# Altium schematic sheet power.SchDoc
size A3
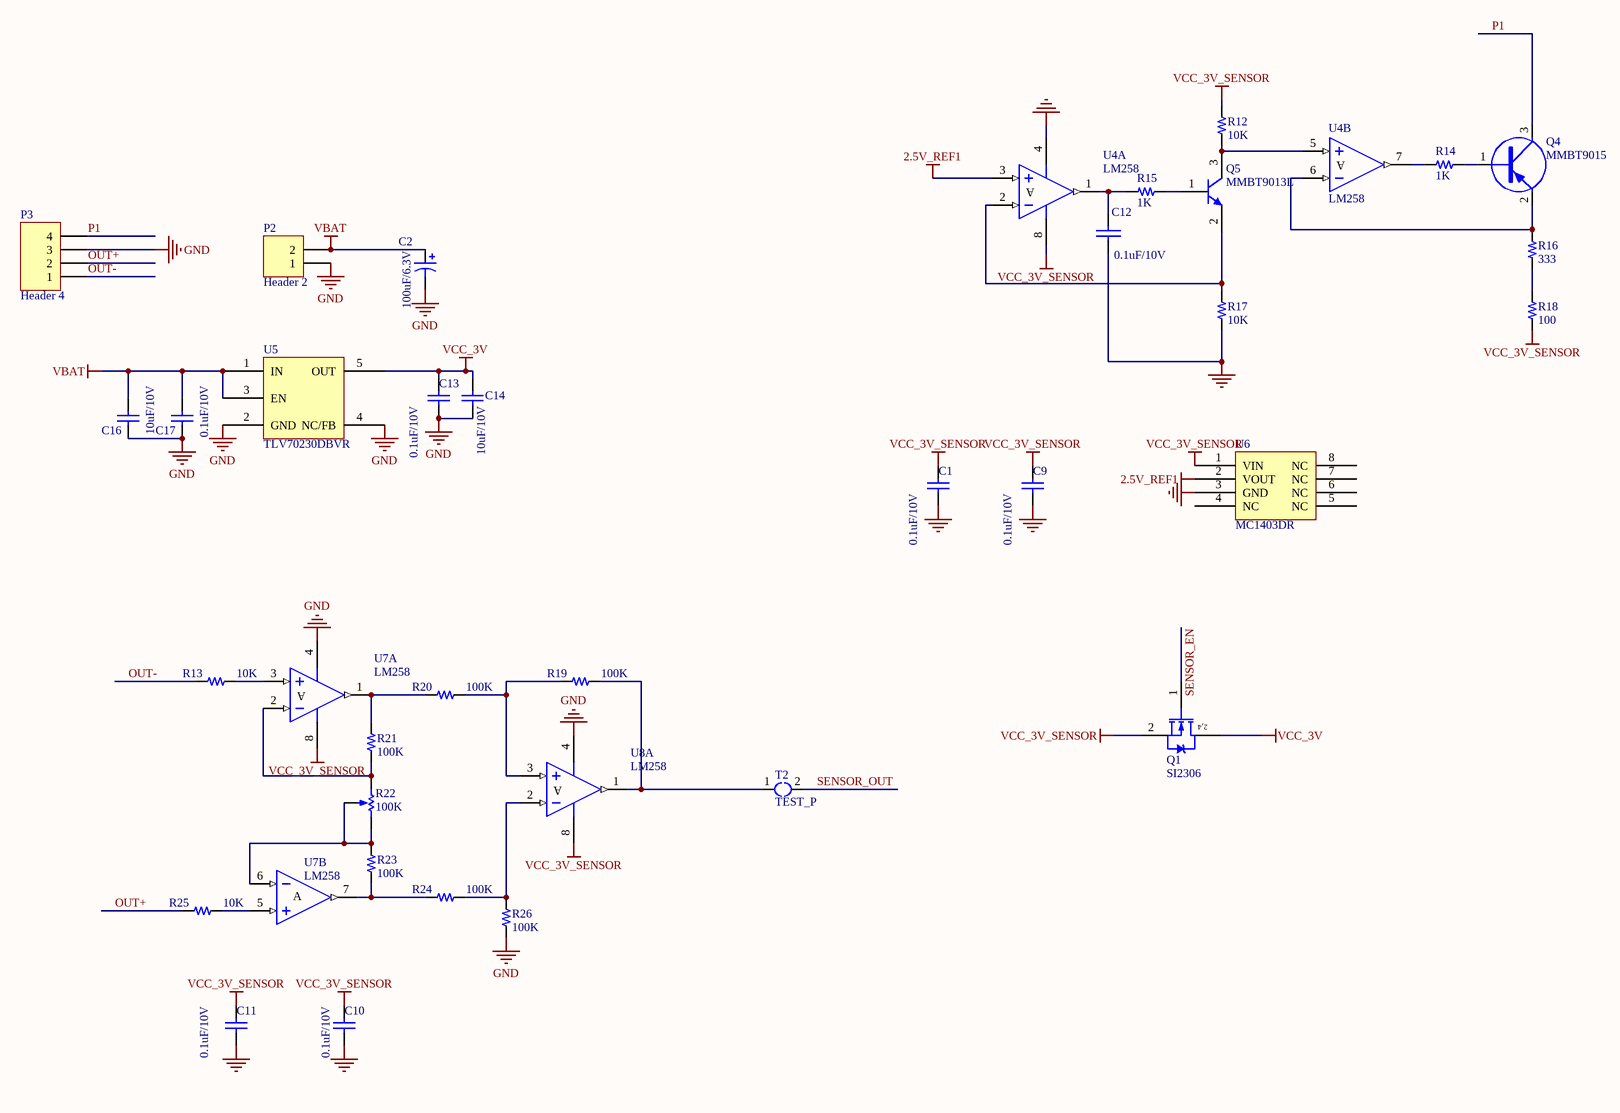
[diagram p0: power.SchDoc]

## Parts
C1  0.1uF/10V  [0603C]
C2  100uF/6.3V  [7343]
C9  0.1uF/10V  [0603C]
C10  0.1uF/10V  [0603C]
C11  0.1uF/10V  [0603C]
C12  0.1uF/10V  [0603C]
C13  0.1uF/10V  [0603C]
C14  10uF/10V  [0603C]
C16  10uF/10V  [0603C]
C17  0.1uF/10V  [0603C]
P2  Header 2  [2X2.54MM]
P3  Header 4  [HDR1X4]
Q1  SI2306  [SOT23-3]
Q4  MMBT9015  [SOT23-3]
Q5  MMBT9013L  [SOT23-3]
R12  10K  [0603R]
R13  10K  [0603R]
R14  1K  [0603R]
R15  1K  [0603R]
R16  333  [0603R]
R17  10K  [0603R]
R18  100  [0603R]
R19  100K  [0603R]
R20  100K  [0603R]
R21  100K  [0603R]
R22  100K  [HDR1X3]
R23  100K  [0603R]
R24  100K  [0603R]
R25  10K  [0603R]
R26  100K  [0603R]
T2  TEST_P  [TEST_P]
U4  LM258  [so-8]  (parts A,B of 2)
U5  TLV70230DBVR  [SOT23-5(DBV)]
U6  MC1403DR  [SO-8]
U7  LM258  [so-8]  (parts A,B of 2)
U8  LM258  [so-8]  (part A of 2)

## Nets
2.5V_REF1: U4.3(IN+) U6.2(VOUT)
GND: C1.2 C2.2 C9.2 C10.2 C11.2 C12.2 C13.2 C14.1 C16.1 C17.2 P2.1 P3.3 R17.1 R26.1 U4.4(V-) U5.2(GND) U5.4(NC/FB) U6.3(GND) U7.4(V-) U8.4(V-)
VBAT: C2.1 C16.2 C17.1 P2.2 U5.1(IN) U5.3(EN)
VCC_3V: C13.1 C14.2 Q1.3(D) U5.5(OUT)
VCC_3V_SENSOR: C1.1 C9.1 C10.1 C11.1 Q1.2(S) R12.2 R18.1 U4.8(V+) U6.1(VIN) U7.8(V+) U8.8(V+)
OUT+: P3.2 R25.1
OUT-: P3.1 R13.1
P1: P3.4 Q4.3(C)
SENSOR_EN: Q1.1(G)
SENSOR_OUT: T2.2
NetC12_1: C12.1 R15.1 U4.1(OUT)
NetQ4_1: Q4.1(B) R14.2
NetQ4_2: Q4.2(E) R16.2 U4.6(IN-)
NetQ5_1: Q5.1(B) R15.2
NetQ5_2: Q5.2(E) R17.2 U4.2(IN-)
NetQ5_3: Q5.3(C) R12.1 U4.5(IN+)
NetR13_2: R13.2 U7.3(IN+)
NetR14_1: R14.1 U4.7(OUT)
NetR16_1: R16.1 R18.2
NetR19_1: R19.1 R20.2 U8.3(IN+)
NetR19_2: R19.2 T2.1 U8.1(OUT)
NetR20_1: R20.1 R21.2 U7.1(OUT)
NetR21_1: R21.1 R22.1(TOP) U7.2(IN-)
NetR22_2: R22.2(BOT) R22.3(TAP) R23.2 U7.6(IN-)
NetR23_1: R23.1 R24.1 U7.7(OUT)
NetR24_2: R24.2 R26.2 U8.2(IN-)
NetR25_2: R25.2 U7.5(IN+)

Not connected (* = marked no-connect by the designer): U6 4(NC) 5(NC) 6(NC) 7(NC) 8(NC)

## Notes on the sheet
- (in symbol BUK92150-55A) 2,4
- (in symbol LM258, part A) A
- (in symbol LM258, part B) A

## Library data of the parts
C1 C9-C11 C13 C17 = Cap: Capacitor; Value: 104; Published: 8-Jun-2000; LatestRevisionDate: 17-Jul-2002; LatestRevisionNote: Re-released for DXP Platform.; PackageReference: RAD-0.3; Publisher: Altium Limited
C2 = Cap Pol1: Polarized Capacitor (Radial); Published: 8-Jun-2000; LatestRevisionDate: 17-Jul-2002; LatestRevisionNote: Re-released for DXP Platform.; PackageReference: RB7.6-15; Publisher: Altium Limited
C12 = CAP: Capacitor
C14 = Cap: Capacitor; Published: 8-Jun-2000; LatestRevisionDate: 17-Jul-2002; LatestRevisionNote: Re-released for DXP Platform.; PackageReference: RAD-0.3; Publisher: Altium Limited; Value: 10uF/10V
C16 = Cap: Capacitor; Value: 106/50V; Published: 8-Jun-2000; LatestRevisionDate: 17-Jul-2002; LatestRevisionNote: Re-released for DXP Platform.; PackageReference: RAD-0.3; Publisher: Altium Limited
P2 = Header 2: Header, 2-Pin; LatestRevisionDate: 17-Jul-2002; LatestRevisionNote: Re-released for DXP Platform.; Publisher: Altium Limited
P3 = Header 4: Header, 4-Pin; LatestRevisionDate: 17-Jul-2002; LatestRevisionNote: Re-released for DXP Platform.; Publisher: Altium Limited
Q1 = BUK92150-55A: Published: 8-Jun-2000; LatestRevisionDate: 17-Jul-2002; LatestRevisionNote: Re-released for DXP Platform.; DatasheetVersion: 6-Oct-1997; PackageVersion: Aug-1998; PackageReference: TSOP-6; Publisher: Altium Limited; PackageDescription: SOT-457/SC-74; 6 Leads; Body 3.1 x 3 mm, inc. leads (LxW max); ComponentLink1Description: Manufacturer Link; ComponentLink1URL: http://www.vishay.com/; ComponentLink2Description: Datasheet; ComponentLink2URL: http://www.vishay.com/docs/70192/70192.pdf
Q4 = PNP
Q5 = NPN
R12-R21 R23-R26 = R
R22 = RPot: Potentiometer; Sim Note: Enter the Resistance value and the set point into parameter fields.; Set Position: 0.5; Value: 1K; Published: 8-Jun-2000; LatestRevisionDate: 17-Jul-2002; LatestRevisionNote: Re-released for DXP Platform.; PackageReference: VR5; Publisher: Altium Limited